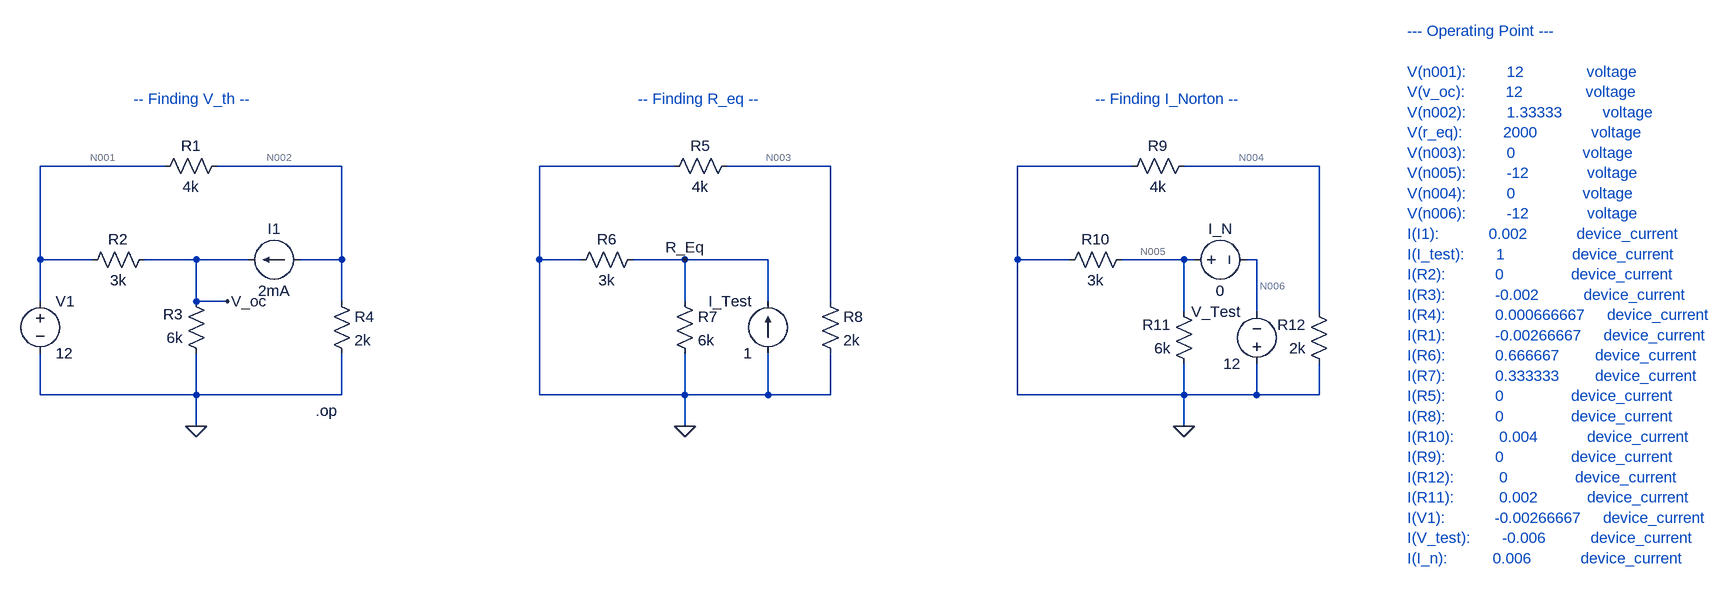
[diagram p0: schematic Draft1.asc]
Draft1.asc, the LTspice schematic file:
Version 4
SHEET 1 2616 680
WIRE 192 -16 0 -16
WIRE 464 -16 272 -16
WIRE 976 -16 768 -16
WIRE 1216 -16 1056 -16
WIRE 1680 -16 1504 -16
WIRE 1968 -16 1760 -16
WIRE 0 128 0 -16
WIRE 80 128 0 128
WIRE 240 128 160 128
WIRE 320 128 240 128
WIRE 464 128 464 -16
WIRE 464 128 400 128
WIRE 768 128 768 -16
WIRE 832 128 768 128
WIRE 992 128 912 128
WIRE 1120 128 992 128
WIRE 1504 128 1504 -16
WIRE 1584 128 1504 128
WIRE 1760 128 1664 128
WIRE 1776 128 1760 128
WIRE 1872 128 1856 128
WIRE 0 192 0 128
WIRE 240 192 240 128
WIRE 288 192 240 192
WIRE 464 192 464 128
WIRE 992 192 992 128
WIRE 1120 192 1120 128
WIRE 1216 192 1216 -16
WIRE 1760 208 1760 128
WIRE 1872 208 1872 128
WIRE 1968 208 1968 -16
WIRE 0 336 0 272
WIRE 240 336 240 272
WIRE 240 336 0 336
WIRE 464 336 464 272
WIRE 464 336 240 336
WIRE 768 336 768 128
WIRE 992 336 992 272
WIRE 992 336 768 336
WIRE 1120 336 1120 272
WIRE 1120 336 992 336
WIRE 1216 336 1216 272
WIRE 1216 336 1120 336
WIRE 1504 336 1504 128
WIRE 1760 336 1760 288
WIRE 1760 336 1504 336
WIRE 1872 336 1872 288
WIRE 1872 336 1760 336
WIRE 1968 336 1968 288
WIRE 1968 336 1872 336
WIRE 240 384 240 336
WIRE 992 384 992 336
WIRE 1760 384 1760 336
FLAG 240 384 0
FLAG 288 192 V_oc
FLAG 992 384 0
FLAG 992 128 R_Eq
FLAG 1760 384 0
SYMBOL voltage 0 176 R0
SYMATTR InstName V1
SYMATTR Value 12
SYMBOL res 176 112 R90
WINDOW 0 0 56 VBottom 2
WINDOW 3 32 56 VTop 2
SYMATTR InstName R2
SYMATTR Value 3k
SYMBOL res 256 288 R180
WINDOW 0 36 76 Left 2
WINDOW 3 36 40 Left 2
SYMATTR InstName R3
SYMATTR Value 6k
SYMBOL res 448 176 R0
SYMATTR InstName R4
SYMATTR Value 2k
SYMBOL current 400 128 R90
WINDOW 0 -32 40 VBottom 2
WINDOW 3 32 40 VTop 2
SYMATTR InstName I1
SYMATTR Value 2mA
SYMBOL res 288 -32 R90
WINDOW 0 0 56 VBottom 2
WINDOW 3 32 56 VTop 2
SYMATTR InstName R1
SYMATTR Value 4k
SYMBOL res 928 112 R90
WINDOW 0 0 56 VBottom 2
WINDOW 3 32 56 VTop 2
SYMATTR InstName R6
SYMATTR Value 3k
SYMBOL res 976 176 R0
SYMATTR InstName R7
SYMATTR Value 6k
SYMBOL res 1072 -32 R90
WINDOW 0 0 56 VBottom 2
WINDOW 3 32 56 VTop 2
SYMATTR InstName R5
SYMATTR Value 4k
SYMBOL res 1200 176 R0
SYMATTR InstName R8
SYMATTR Value 2k
SYMBOL current 1120 272 R180
WINDOW 0 24 80 Left 2
WINDOW 3 24 0 Left 2
SYMATTR InstName I_Test
SYMATTR Value 1
SYMBOL res 1568 144 R270
WINDOW 0 32 56 VTop 2
WINDOW 3 0 56 VBottom 2
SYMATTR InstName R10
SYMATTR Value 3k
SYMBOL res 1664 0 R270
WINDOW 0 32 56 VTop 2
WINDOW 3 0 56 VBottom 2
SYMATTR InstName R9
SYMATTR Value 4k
SYMBOL res 1984 304 R180
WINDOW 0 36 76 Left 2
WINDOW 3 36 40 Left 2
SYMATTR InstName R12
SYMATTR Value 2k
SYMBOL res 1776 304 R180
WINDOW 0 36 76 Left 2
WINDOW 3 36 40 Left 2
SYMATTR InstName R11
SYMATTR Value 6k
SYMBOL voltage 1872 304 R180
WINDOW 0 24 96 Left 2
WINDOW 3 24 16 Left 2
SYMATTR InstName V_Test
SYMATTR Value 12
SYMBOL voltage 1760 128 R270
WINDOW 0 32 56 VTop 2
WINDOW 3 -32 56 VBottom 2
SYMATTR InstName I_N
SYMATTR Value 0
TEXT 424 360 Left 2 !.op
TEXT 144 -120 Left 2 ;-- Finding V_th --
TEXT 920 -120 Left 2 ;-- Finding R_eq --
TEXT 1624 -120 Left 2 ;-- Finding I_Norton --
TEXT 2104 -224 Left 2 ;--- Operating Point ---\n \nV(n001):         12              voltage\nV(v_oc):         12              voltage\nV(n002):         1.33333         voltage\nV(r_eq):         2000            voltage\nV(n003):         0               voltage\nV(n005):         -12             voltage\nV(n004):         0               voltage\nV(n006):         -12             voltage\nI(I1):           0.002           device_current\nI(I_test):       1               device_current\nI(R2):           0               device_current\nI(R3):           -0.002          device_current\nI(R4):           0.000666667     device_current\nI(R1):           -0.00266667     device_current\nI(R6):           0.666667        device_current\nI(R7):           0.333333        device_current\nI(R5):           0               device_current\nI(R8):           0               device_current\nI(R10):          0.004           device_current\nI(R9):           0               device_current\nI(R12):          0               device_current\nI(R11):          0.002           device_current\nI(V1):           -0.00266667     device_current\nI(V_test):       -0.006          device_current\nI(I_n):          0.006           device_current

The netlist it stands for:
* Draft1.asc
V1 N001 0 12
R2 V_oc N001 3k
R3 0 V_oc 6k
R4 N002 0 2k
I1 N002 V_oc 2mA
R1 N002 N001 4k
R6 R_Eq 0 3k
R7 R_Eq 0 6k
R5 N003 0 4k
R8 N003 0 2k
I_Test 0 R_Eq 1
R10 0 N005 3k
R9 0 N004 4k
R12 0 N004 2k
R11 0 N005 6k
V_Test 0 N006 12
V§I_N N005 N006 0
.op
* -- Finding V_th --
* -- Finding R_eq --
* -- Finding I_Norton --
* --- Operating Point ---
* V(n001):         12              voltage
* V(v_oc):         12              voltage
* V(n002):         1.33333         voltage
* V(r_eq):         2000            voltage
* V(n003):         0               voltage
* V(n005):         -12             voltage
* V(n004):         0               voltage
* V(n006):         -12             voltage
* I(I1):           0.002           device_current
* I(I_test):       1               device_current
* I(R2):           0               device_current
* I(R3):           -0.002          device_current
* I(R4):           0.000666667     device_current
* I(R1):           -0.00266667     device_current
* I(R6):           0.666667        device_current
* I(R7):           0.333333        device_current
* I(R5):           0               device_current
* I(R8):           0               device_current
* I(R10):          0.004           device_current
* I(R9):           0               device_current
* I(R12):          0               device_current
* I(R11):          0.002           device_current
* I(V1):           -0.00266667     device_current
* I(V_test):       -0.006          device_current
* I(I_n):          0.006           device_current
.backanno
.end

* Results of the author's LTspice run, read from the files saved beside the schematic
* Operating Point:
*   V(n001) = 12 V
*   V(v_oc) = 12 V
*   V(n002) = 1.333 V
*   V(r_eq) = 2 kV
*   V(n003) = 0 V
*   V(n005) = -12 V
*   V(n004) = 0 V
*   V(n006) = -12 V
*   I(I1) = 2 mA
*   I(I_test) = 1 A
*   I(R2) = 0 A
*   I(R3) = -2 mA
*   I(R4) = 666.7 µA
*   I(R1) = -2.667 mA
*   I(R6) = 666.7 mA
*   I(R7) = 333.3 mA
*   I(R5) = 0 A
*   I(R8) = 0 A
*   I(R10) = 4 mA
*   I(R9) = 0 A
*   I(R12) = 0 A
*   I(R11) = 2 mA
*   I(V1) = -2.667 mA
*   I(V_test) = -6 mA
*   I(I_n) = 6 mA